# EAGLE design Wash_Hand_v1.2-routing (EAGLE 9.6.1)
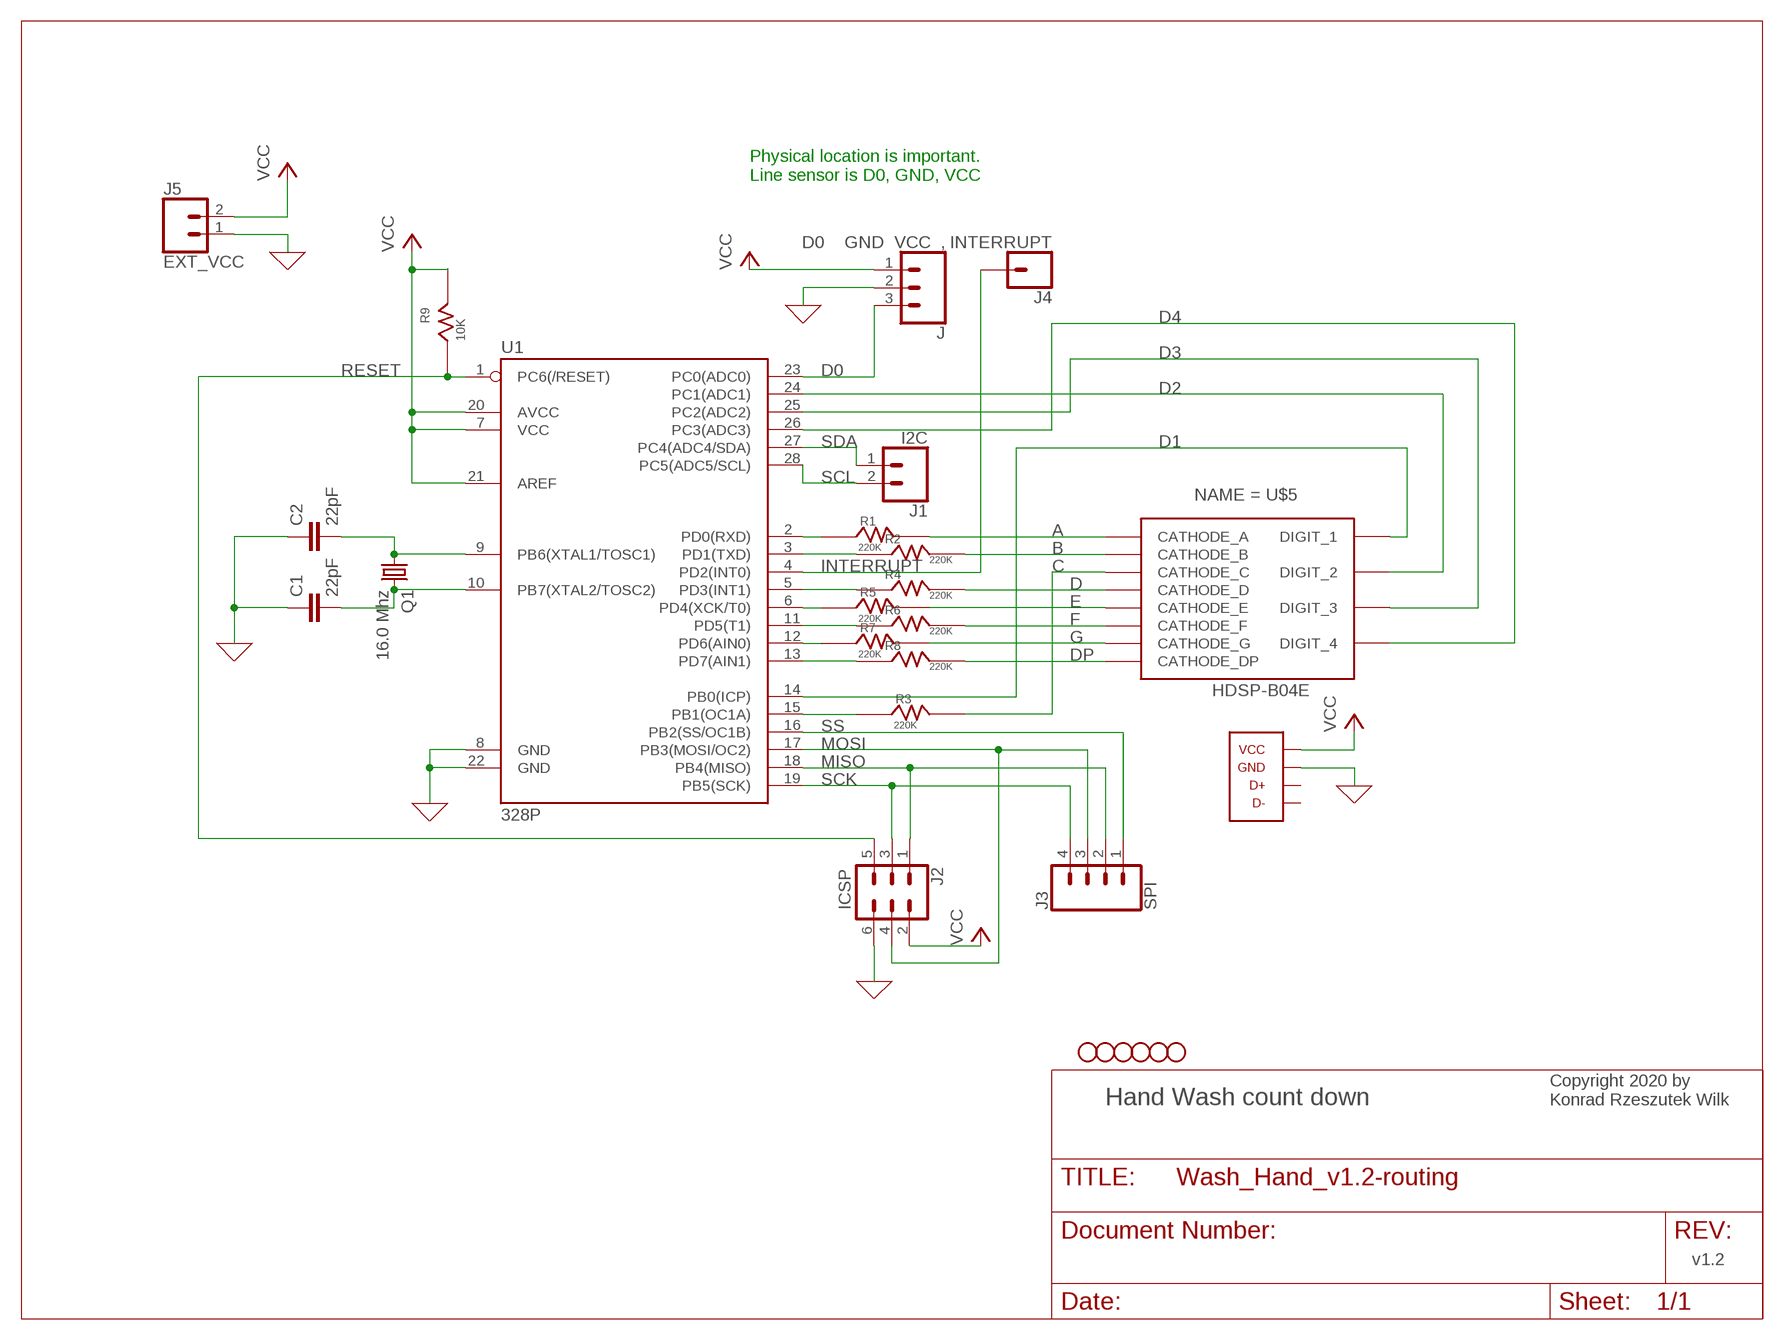
[diagram p0: schematic, sheet 1]

## Parts
C1  22pF  22PF-PTH-2.54MM-200V-5%  [CAP-PTH-2.54]
C2  22pF  22PF-PTH-2.54MM-200V-5%  [CAP-PTH-2.54]
H1  STAND-OFF  [STAND-OFF]
H2  STAND-OFF  [STAND-OFF]
H3  STAND-OFF  [STAND-OFF]
H4  STAND-OFF  [STAND-OFF]
H5  STAND-OFF  [STAND-OFF]
H6  STAND-OFF  [STAND-OFF]
J  D0 GND VCC ,  CONN_03  [1X03]
J1  I2C  CONN_02  [1X02]
J2  ICSP  CONN_03X2FEMALE  [2X3]
J3  SPI  CONN_04  [1X04]
J4  INTERRUPT  CONN_01  [1X01]
J5  EXT_VCC  CONN_02  [1X02]
Q1  16.0 Mhz  CRYSTALHC49S  [HC49/S]
R1  220K  RESISTOR  [RESISTOR]
R2  220K  RESISTOR  [RESISTOR]
R3  220K  RESISTOR  [RESISTOR]
R4  220K  RESISTOR  [RESISTOR]
R5  220K  RESISTOR  [RESISTOR]
R6  220K  RESISTOR  [RESISTOR]
R7  220K  RESISTOR  [RESISTOR]
R8  220K  RESISTOR  [RESISTOR]
R9  10K  RESISTOR  [RESISTOR]
U1  328P  ATMEGA328P_PDIP  [DIP28]
U$4  USB_MICROB_10118194_AMPHENOL  [USB_MICROB_10118194_AMPHENOL]
U$5  HDSP-B04E  [HDSP-B0XE]

## Nets
0: C1.1 C2.1 J2.6 J5.1 J.2 U1.8(GND) U1.22(GND) U$4.5(GND) ; supply symbol labelled GND
A: R1.R_2 U$5.PIN$11(CATHODE_A)
B: R2.R_2 U$5.PIN$7(CATHODE_B)
C: R3.R_2 U$5.PIN$4(CATHODE_C)
D: R4.R_2 U$5.PIN$2(CATHODE_D)
D0: J.3 U1.23(PC0(ADC0))
D1: U1.14(PB0(ICP)) U$5.PIN12(DIGIT_1)
D2: U1.24(PC1(ADC1)) U$5.PIN$9(DIGIT_2)
D3: U1.25(PC2(ADC2)) U$5.PIN$8(DIGIT_3)
D4: U1.26(PC3(ADC3)) U$5.PIN$6(DIGIT_4)
DP: R8.R_2 U$5.PIN$3(CATHODE_DP)
E: R5.R_2 U$5.PIN$1(CATHODE_E)
F: R6.R_2 U$5.PIN$10(CATHODE_F)
G: R7.R_2 U$5.PIN$5(CATHODE_G)
INTERRUPT: J4.1 U1.4(PD2(INT0))
MISO: J2.1 J3.2 U1.18(PB4(MISO))
MOSI: J2.4 J3.3 U1.17(PB3(MOSI/OC2))
N$1: R3.R_1 U1.15(PB1(OC1A))
N$2: R1.R_1 U1.2(PD0(RXD))
N$3: R5.R_1 U1.6(PD4(XCK/T0))
N$4: R7.R_1 U1.12(PD6(AIN0))
N$8: C1.2 Q1.2 U1.10(PB7(XTAL2/TOSC2))
N$9: C2.2 Q1.1 U1.9(PB6(XTAL1/TOSC1))
N$18: R8.R_1 U1.13(PD7(AIN1))
N$19: R6.R_1 U1.11(PD5(T1))
N$20: R4.R_1 U1.5(PD3(INT1))
N$21: R2.R_1 U1.3(PD1(TXD))
RESET: J2.5 R9.R_1 U1.1(PC6(/RESET))
SCK: J2.3 J3.4 U1.19(PB5(SCK))
SCL: J1.2 U1.28(PC5(ADC5/SCL))
SDA: J1.1 U1.27(PC4(ADC4/SDA))
SS: J3.1 U1.16(PB2(SS/OC1B))
VCC: J2.2 J5.2 J.1 R9.R_2 U1.7(VCC) U1.20(AVCC) U1.21(AREF) U$4.1(VCC)
Unconnected: U$4.2(D-) U$4.3(D+)

## Notes on the sheet
- Physical location is important.
  Line sensor is D0, GND, VCC
- Hand Wash count down
- Copyright 2020 by
  Konrad Rzeszutek Wilk
- v1.2

## Library data of the parts
C1 C2 = SparkFun-Capacitors:22PF: 22pF ceramic capacitors A capacitor is a passive two-terminal electrical component used to store electrical energy temporarily in an electric field.; PROD_ID: CAP-09128
H1-H6 = SparkFun-Hardware:STAND-OFF: Stand Off Drill holes for mechanically mounting via screws, standoffs, etc. Note: Use the keepout ring to avoid running the screw head into surrounding components. Variant Overviews STAND-OFF - Mechanical footprint for a #4 phillips button head screw. STAND-OFF-TIGHT - Mechanical footprint for a #4 phillips button head screw, Example SparkFun Products Screw - Phillips Head (1/4", 4-40, 10 pack) <https://www.sparkfun.com/products/10453> (PRT-10453) Screw - Phillips Head (1/2", 4-40, 10 pack) <https://www.sparkfun.com/products/10452> (PRT-10452) Screw - Phillips Head (3/4", 4-40, 10 pack) <https://www.sparkfun.com/products/10451> (PRT-10451) Screw - Phillips Head (1", 4-40, 10 pack) <https://www.sparkfun.com/products/10450> (PRT-10450)
J = SparkFun-Connectors:CONN_03: Multi connection point. Often used as Generic Header-pin footprint for 0.1 inch spaced/style header connections On any of the 0.1 inch spaced packages, you can populate with these: Break Away Headers - Straight <https://www.sparkfun.com/products/116> (PRT-00116) Break Away Male Headers - Right Angle <https://www.sparkfun.com/products/553> (PRT-00553) Female Headers <https://www.sparkfun.com/products/115> (PRT-00115) Break Away Headers - Machine Pin <https://www.sparkfun.com/products/117> (PRT-00117) Break Away Female Headers - Swiss Machine Pin <https://www.sparkfun.com/products/743> (PRT-00743) Stackable Header - 3 Pin (Female, 0.1") <https://www.sparkfun.com/products/13875> (PRT-13875) For SCREWTERMINALS and SPRING TERMINALS visit here: Screw Terimnals on SparkFun.com <https://www.sparkfun.com/search/results?term=Screw+Terminals> (5mm/3.5mm/2.54mm spacing) This device is also useful as a general connection point to wire up your design to another part of your project. Our various solder wires solder well into these plated through hole pads. Hook-Up Wire - Assortment (Stranded, 22 AWG) <https://www.sparkfun.com/products/11375> (PRT-11375) Hook-Up Wire - Assortment (Solid Core, 22 AWG) <https://www.sparkfun.com/products/11367> (PRT-11367) View the entire wire category on our website here <https://www.sparkfun.com/categories/141> Special notes: Molex polarized connector foot print use with SKU : PRT-08232 with associated crimp pins and housings.
J1 J5 = SparkFun-Connectors:CONN_02: Multi connection point. Often used as Generic Header-pin footprint for 0.1 inch spaced/style header connections On any of the 0.1 inch spaced packages, you can populate with these: Break Away Headers - Straight <https://www.sparkfun.com/products/116> (PRT-00116) Break Away Male Headers - Right Angle <https://www.sparkfun.com/products/553> (PRT-00553) Female Headers <https://www.sparkfun.com/products/115> (PRT-00115) Break Away Headers - Machine Pin <https://www.sparkfun.com/products/117> (PRT-00117) Break Away Female Headers - Swiss Machine Pin <https://www.sparkfun.com/products/743> (PRT-00743) For SCREWTERMINALS and SPRING TERMINALS visit here: Screw Terimnals on SparkFun.com <https://www.sparkfun.com/search/results?term=Screw+Terminals> (5mm/3.5mm/2.54mm spacing) This device is also useful as a general connection point to wire up your design to another part of your project. Our various solder wires solder well into these plated through hole pads. Hook-Up Wire - Assortment (Stranded, 22 AWG) <https://www.sparkfun.com/products/11375> (PRT-11375) Hook-Up Wire - Assortment (Solid Core, 22 AWG) <https://www.sparkfun.com/products/11367> (PRT-11367) View the entire wire category on our website here <https://www.sparkfun.com/categories/141> Special notes: Molex polarized connector foot print use with: PRT-08233 with associated crimp pins and housings. 2.54_SCREWTERM for use with PRT-10571. 3.5mm Screw Terminal footprints for PRT-08084 5mm Screw Terminal footprints for use with PRT-08432
J2 = SparkFun-Connectors:CONN_03X2: Multi connection point. Often used as Generic Header-pin footprint for 0.1 inch spaced/style header connections You can populate with any combo of single row headers, but if you'd like an exact match, check these: Header - 2x3 (Male, 0.1") <https://www.sparkfun.com/products/12807> (PRT-12807) Header - 2x3 (Female, 0.1") <https://www.sparkfun.com/products/13010> (PRT-13010) 2x3 Pin Shrouded Header <https://www.sparkfun.com/products/10877> (PRT-10877) On any of the 0.1 inch spaced packages, you can populate with these: Break Away Headers - Straight <https://www.sparkfun.com/products/116> (PRT-00116) Break Away Male Headers - Right Angle <https://www.sparkfun.com/products/553> (PRT-00553) Female Headers <https://www.sparkfun.com/products/115> (PRT-00115) Break Away Headers - Machine Pin <https://www.sparkfun.com/products/117> (PRT-00117) Break Away Female Headers - Swiss Machine Pin <https://www.sparkfun.com/products/743> (PRT-00743) Special note: the shrouded connector mates well with our 3x2 ribbon cables: Ribbon Crimp Connector - 6-pin (2x3, Female) <https://www.sparkfun.com/products/10651> (PRT-10651) Ribbon Cable - 6 wire (15ft) <https://www.sparkfun.com/products/10646> (PRT-10646); PROD_ID: CONN-11566; VALUE: FEMALE 2x3
J3 = SparkFun-Connectors:CONN_04: Multi connection point. Often used as Generic Header-pin footprint for 0.1 inch spaced/style header connections On any of the 0.1 inch spaced packages, you can populate with these: Break Away Headers - Straight <https://www.sparkfun.com/products/116> (PRT-00116) Break Away Male Headers - Right Angle <https://www.sparkfun.com/products/553> (PRT-00553) Female Headers <https://www.sparkfun.com/products/115> (PRT-00115) Break Away Headers - Machine Pin <https://www.sparkfun.com/products/117> (PRT-00117) Break Away Female Headers - Swiss Machine Pin <https://www.sparkfun.com/products/743> (PRT-00743) For SCREWTERMINALS and SPRING TERMINALS visit here: Screw Terimnals on SparkFun.com <https://www.sparkfun.com/search/results?term=Screw+Terminals> (5mm/3.5mm/2.54mm spacing) This device is also useful as a general connection point to wire up your design to another part of your project. Our various solder wires solder well into these plated through hole pads. Hook-Up Wire - Assortment (Stranded, 22 AWG) <https://www.sparkfun.com/products/11375> (PRT-11375) Hook-Up Wire - Assortment (Solid Core, 22 AWG) <https://www.sparkfun.com/products/11367> (PRT-11367) View the entire wire category on our website here <https://www.sparkfun.com/categories/141> Special notes: Molex polarized connector foot print use with SKU : PRT-08231 with associated crimp pins and housings. 1MM SMD Version SKU: PRT-10208; PROD_ID: CONN-09696
J4 = SparkFun-Connectors:CONN_01: Single connection point. Often used as Generic Header-pin footprint for 0.1 inch spaced/style header connections On any of the 0.1 inch spaced packages, you can populate with these: Break Away Headers - Straight <https://www.sparkfun.com/products/116> (PRT-00116) Break Away Male Headers - Right Angle <https://www.sparkfun.com/products/553> (PRT-00553) Female Headers <https://www.sparkfun.com/products/115> (PRT-00115) Break Away Headers - Machine Pin <https://www.sparkfun.com/products/117> (PRT-00117) Break Away Female Headers - Swiss Machine Pin <https://www.sparkfun.com/products/743> (PRT-00743) This device is also useful as a general connection point to wire up your design to another part of your project. Our various solder wires solder well into these plated through hole pads. Hook-Up Wire - Assortment (Stranded, 22 AWG) <https://www.sparkfun.com/products/11375> (PRT-11375) Hook-Up Wire - Assortment (Solid Core, 22 AWG) <https://www.sparkfun.com/products/11367> (PRT-11367) View the entire wire category on our website here <https://www.sparkfun.com/categories/141> Special notes: SMTSO-256-ET is a "flush mount" nut for a 4-40 screw. We mostly use this on specialty testbeds; it is a nice way to connect hardware to your PCB at an adjustable hieght. Also note, the SNAP packages are for using a snappable style connector. We sell a baggie of snaps and they are also used on two LilyPad designs: Snap Assortment - 30 pack (male and female) <https://www.sparkfun.com/products/11347> (DEV-11347) LilyPad Arduino SimpleSnap <https://www.sparkfun.com/products/10941> (DEV-10941) LilyPad SimpleSnap Protoboard <https://www.sparkfun.com/products/10940> (DEV-10940)
Q1 = adafruit:CRYSTAL: CRYSTAL; OC_FARNELL: 1667008; OC_NEWARK: unknown
R1-R9 = PCB_CLASS_PREMADE_COMPONENTS:RESISTOR
U1 = SparkFun-IC-Microcontroller:ATMEGA328P_PDIP: Atmel 328P Through hole ATMEGA328P uC used in the Arduino 32kb flash, 1k EEPROM, 2k SRAM Datasheet <http://www.sparkfun.com/datasheets/Components/SMD/ATMega328.pdf> SparkFun Products Storefront component: AVR 28 Pin 20MHz 32K 6A/D - ATMega328P <https://www.sparkfun.com/products/9061> (COM-09061) SparkFun Simon Says - Through-Hole Soldering Kit <https://www.sparkfun.com/products/10547> (KIT-10547) SparkFun Learn to Solder - Simon Says <https://www.sparkfun.com/products/13708> (KIT-13708) SparkFun BigTime Watch Kit <https://www.sparkfun.com/products/11734> (KIT-11734) SparkFun ClockIt <https://www.sparkfun.com/products/10930> (KIT-10930) SparkFun Serial Enabled LCD Kit <https://www.sparkfun.com/products/10097> (LCD-10097) SparkFun Simon Tilts - Through Hole Soldering Kit <https://www.sparkfun.com/products/12634> (KIT-12634) SparkFun Frequency Counter Kit <https://www.sparkfun.com/products/10140> (KIT-10140) FabFM Radio Kit <https://www.sparkfun.com/products/11043> (KIT-11043) SparkFun Binary Blaster Kit <https://www.sparkfun.com/products/12037> (KIT-12037) SparkFun Metro-Gnome <https://www.sparkfun.com/products/9236> (KIT-09236) ATmega328 with Arduino Optiboot (Uno) <https://www.sparkfun.com/products/10524> (DEV-10524); PROD_ID: IC-09136
U$4 = PCB_CLASS_PREMADE_COMPONENTS:USB_MICROB_10118194_AMPHENOL
U$5 = PCB_CLASS_PREMADE_COMPONENTS:HDSP-B04E: 7 Segment LED light 0.56"

## Board
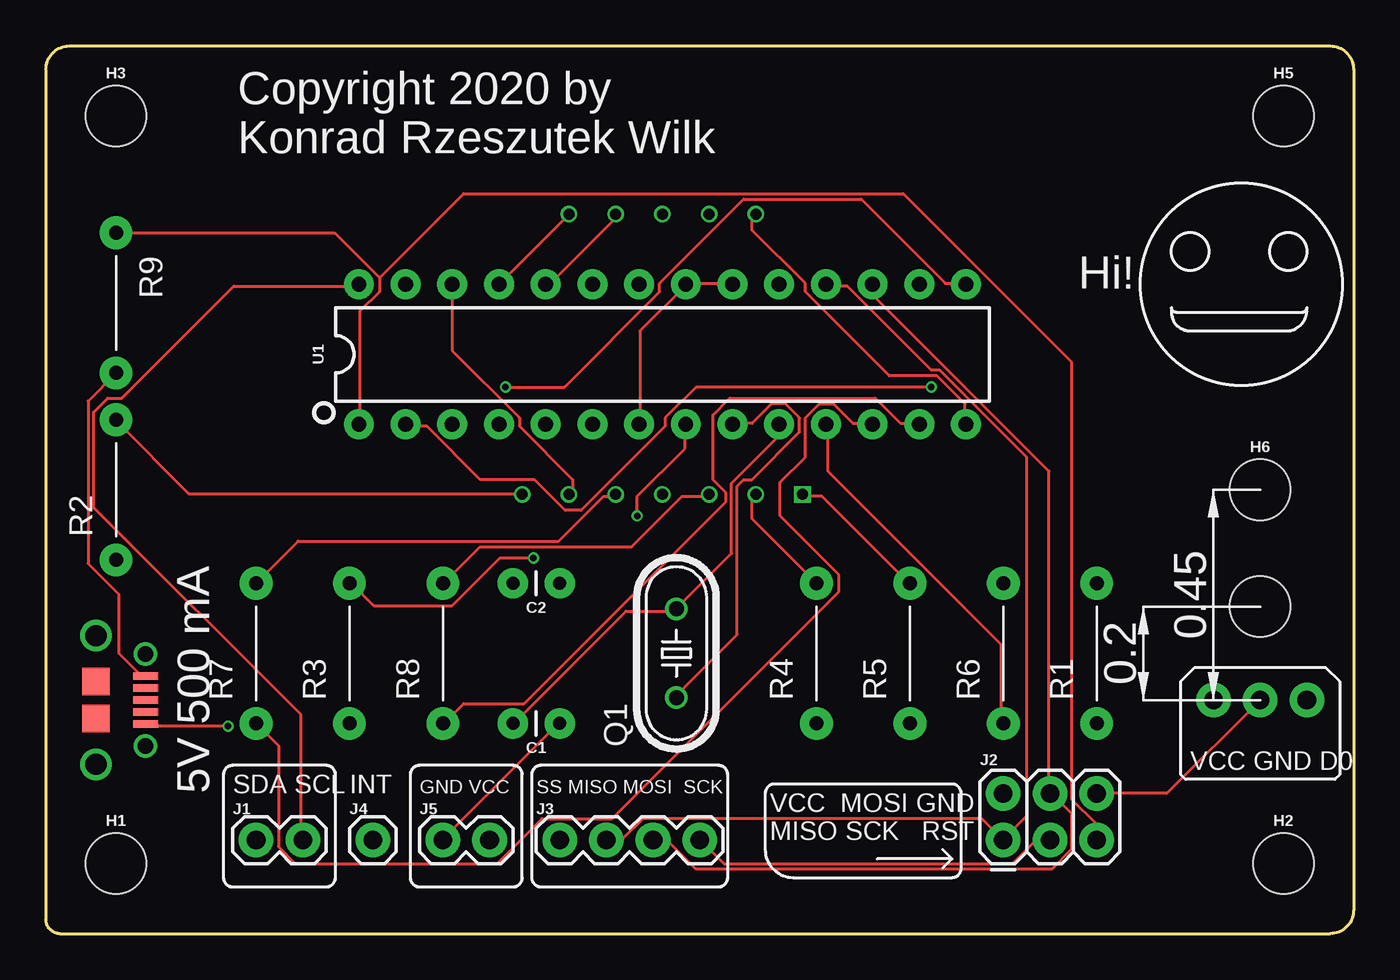
[diagram p1: board, top side]
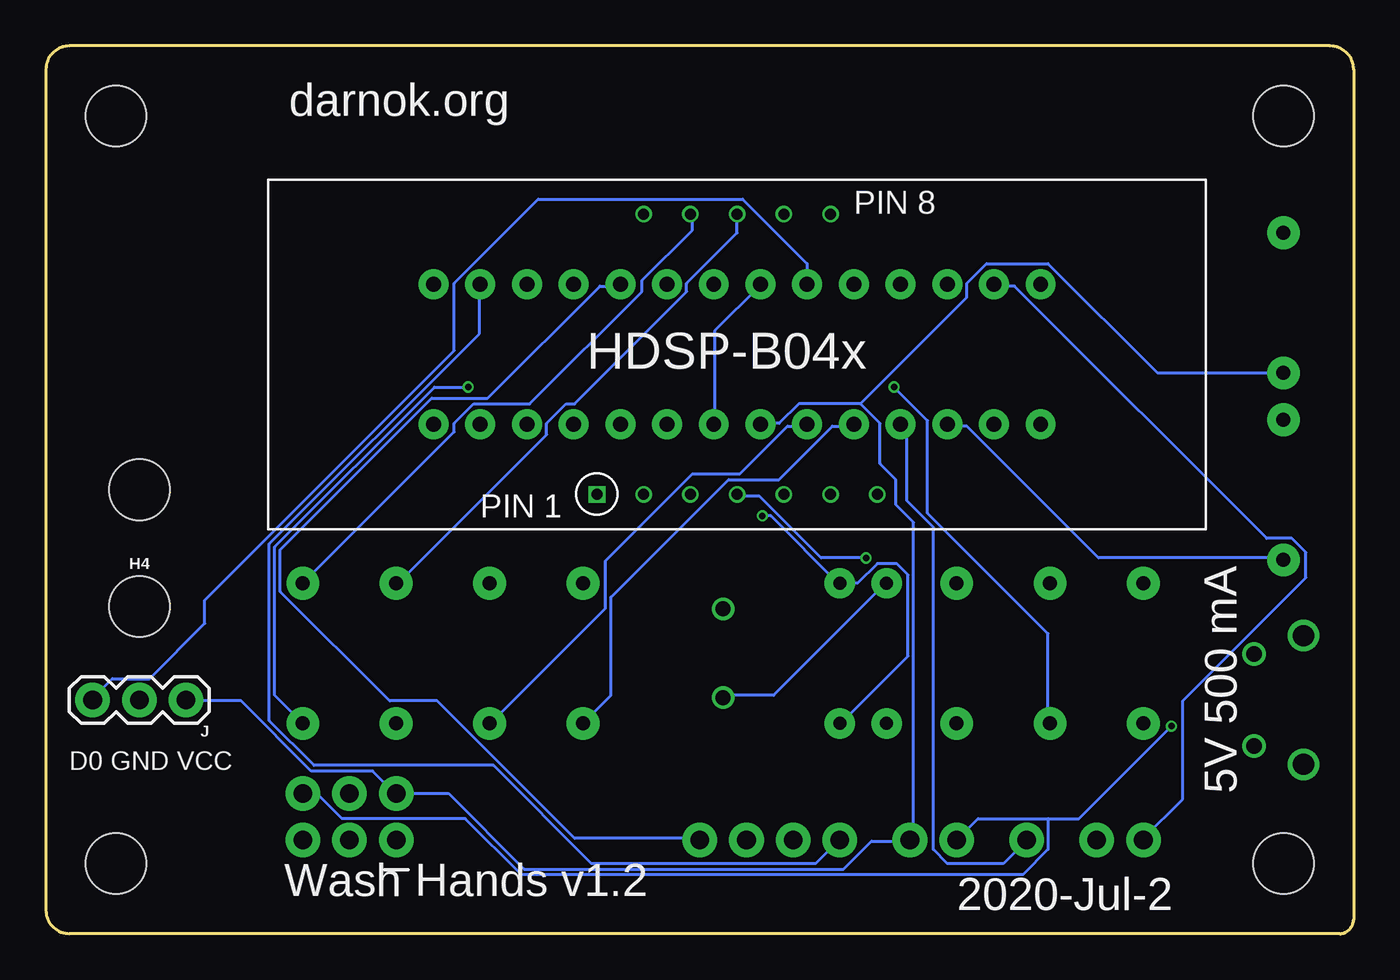
[diagram p2: board, bottom side, seen from below]

Size 71.12 x 48.26 mm. Coordinates in mm from the lower left corner, seen from the top.
Outline: 0,46.99 0,0.76 arc90 0.76,0 69.85,0 arc90 71.12,1.27 71.12,46.99 arc90 69.85,48.26 1.27,48.26 arc90 0,46.99
Copper layers (1*16): Top 0.035559375mm / dielectric 1.6mm / Bottom 0.035559375mm
Design rules "oshpark-2layer": minimum track width 6mil, minimum drill 10mil, track to track 6mil, track to pad 6mil, pad to pad 6mil, via to via 6mil, smd to smd 6mil, copper to edge 15mil, drill to drill 6mil, minimum pad ring 5mil, minimum via ring 5mil, stop-mask expansion 2.5mil, vias tented up to drill 0mil, thermal gap 10mil

### Footprints (pad centres in the part's own frame; a part is rotated, then mirrored left to right if it is on the bottom)
CAP-PTH-2.54 = drill 0.7 pad 1.651: 1 -1.27,0; 2 1.27,0
STAND-OFF = hole 3.302: 0,0
1X03 = drill 1.016 pad 1.88: 1 0,0; 2 2.54,0; 3 5.08,0
1X02 = drill 1.016 pad 1.88: 1 0,0; 2 2.54,0
2X3 = drill 1.016 pad 1.88: 1 0,0; 2 0,2.54; 3 2.54,0; 4 2.54,2.54; 5 5.08,0; 6 5.08,2.54
1X04 = drill 1.016 pad 1.88: 1 0,0; 2 2.54,0; 3 5.08,0; 4 7.62,0
1X01 = drill 1.016 pad 1.88: 1 0,0
HC49/S = drill 0.813: 1 -2.413,0; 2 2.413,0
RESISTOR = drill 0.762 pad 1.778: R_1 0,0; R_2 7.62,0
DIP28 = drill 0.813 pad 1.626: 1 -16.51,-3.81; 2 -13.97,-3.81; 3 -11.43,-3.81; 4 -8.89,-3.81; 5 -6.35,-3.81; 6 -3.81,-3.81; 7 -1.27,-3.81; 8 1.27,-3.81; 9 3.81,-3.81; 10 6.35,-3.81; 11 8.89,-3.81; 12 11.43,-3.81; 13 13.97,-3.81; 14 16.51,-3.81; 15 16.51,3.81; 16 13.97,3.81; 17 11.43,3.81; 18 8.89,3.81; 19 6.35,3.81; 20 3.81,3.81; 21 1.27,3.81; 22 -1.27,3.81; 23 -3.81,3.81; 24 -6.35,3.81; 25 -8.89,3.81; 26 -11.43,3.81; 27 -13.97,3.81; 28 -16.51,3.81
USB_MICROB_10118194_AMPHENOL = smd 0.4 x 1.35: 1 -1.3,4.15; 2 -0.65,4.15; 3 0,4.15; 4 0.65,4.15; 5 1.3,4.15 | smd 1.5 x 1.5: P$1 -1,1.45; P$2 1,1.45 | drill 0.85 pad 1.25: P$8 -2.5,4.15; P$9 2.5,4.15 | drill 1.15 pad 1.55: P$10 -3.5,1.45; P$11 3.5,1.45
HDSP-B0XE = drill 0.6: PIN12 -5.08,7.62; PIN$2 -5.08,-7.62; PIN$3 -2.54,-7.62; PIN$4 0,-7.62; PIN$5 2.54,-7.62; PIN$6 5.08,-7.62; PIN$7 7.62,-7.62; PIN$8 5.08,7.62; PIN$9 2.54,7.62; PIN$10 0,7.62; PIN$11 -2.54,7.62 | drill 0.6 square: PIN$1 -7.62,-7.62

### Placement (x,y rotation side)
C1  26.67,11.43 180 top
C2  26.67,19.05 180 top
H1  3.81,3.81 0 top
H2  67.31,3.81 0 top
H3  3.81,44.45 0 top
H4  66.04,17.78 0 bottom
H5  67.31,44.45 0 top
H6  66.04,24.13 0 top
J  63.5,12.7 180 bottom
J1  11.43,5.08 0 top
J2  52.07,5.08 0 top
J3  27.94,5.08 0 top
J4  17.78,5.08 0 top
J5  21.59,5.08 0 top
Q1  34.29,15.24 90 top
R1  57.15,11.43 90 top
R2  3.81,20.32 90 top
R3  16.51,11.43 90 top
R4  41.91,11.43 90 top
R5  46.99,11.43 90 top
R6  52.07,11.43 90 top
R7  11.43,11.43 90 top
R8  21.59,11.43 90 top
R9  3.81,38.1 270 top
U1  33.53,31.5 0 top
U$4  1.27,12.7 270 top
U$5  33.53,31.5 0 bottom

### Tracks (layer width: path | path; a pad name or v marks a point on that pad's centre or on a via)
0  (via drill 0.35)
  Top 0.152: J2.6 60.96,7.62 J.2 | v9.91,11.28 5.49,11.28 U$4.5 | C1.1 27.89,11.43 21.64,5.18 J5.1 | v32.16,22.71 32.16,23.77 34.75,26.36 34.75,27.58 U1.8
  Bottom 0.152: U1.8 34.75,27.74 34.75,32.77 32.31,35.2 U1.22 | v9.91,11.28 14.94,6.25 16.61,6.25 | 16.61,6.25 20.42,6.25 J5.1 | C1.1 27.89,11.43 24.23,15.09 24.23,19.51 24.84,20.12 25.91,20.12 26.98,19.05 C2.1 28.04,19.05 31.7,22.71 v32.16,22.71 | J2.6 56.39,7.62 55.02,6.25 48.31,6.25 45.26,3.2 17.98,3.2 16.61,4.57 16.61,6.25
A
  Bottom 0.152: R1.R_2 48.92,27.28 48.92,27.74 47.85,28.8 44.81,28.8 38.71,34.9 38.71,35.51 35.97,38.25 35.97,39.01 U$5.PIN$11
B
  Top 0.152: U$5.PIN$7 26.21,23.93 7.77,23.93 3.81,27.89 R2.R_2
C  (via drill 0.35)
  Top 0.152: v26.52,20.42 24.69,20.42 22.1,17.83 17.83,17.83 16.61,19.05 R3.R_2
  Bottom 0.152: v26.52,20.42 28.96,20.42 32.31,23.77 33.53,23.77 U$5.PIN$4
D
  Top 0.152: R4.R_2 38.41,22.55 38.41,23.77 U$5.PIN$2
D0
  Bottom 0.152: U1.23 29.72,36.42 33.22,39.93 44.35,39.93 48.92,35.36 48.92,31.7 62.48,18.14 62.48,16.87 65.48,13.87 67.51,13.87 68.58,12.8 J.3
D1
  Top 0.152: U$5.PIN12 38.41,39.01 38.41,38.25 41.3,35.36 41.3,34.9 45.87,30.33 48.46,30.33 49.99,28.8 49.99,27.74 U1.14
D2
  Top 0.152: U$5.PIN$9 31.09,39.01 27.28,35.2 U1.24
D3
  Top 0.152: U1.25 28.35,39.01 28.65,39.01 U$5.PIN$8
D4
  Top 0.152: U1.26 22.1,31.7 25.76,28.04 25.76,27.58 28.65,24.69 28.65,23.93 U$5.PIN$6
DP
  Top 0.152: U$5.PIN$3 35.81,23.77 34.59,23.77 31.85,21.03 23.62,21.03 21.64,19.05 R8.R_2
E
  Top 0.152: U$5.PIN$1 40.84,23.77 42.22,23.77 46.94,19.05 R5.R_2
F
  Bottom 0.152: U$5.PIN$10 33.53,38.1 36.27,35.36 36.27,34.9 42.37,28.8 42.82,28.8 43.89,27.74 43.89,27.13 51.97,19.05 R6.R_2
G
  Top 0.152: R7.R_2 13.72,21.34 27.89,21.34 30.33,23.77 31.09,23.77 U$5.PIN$5
INTERRUPT
  Bottom 0.152: J4.1 19.05,3.81 22.1,3.81 22.86,4.57 22.86,22.1 24.28,23.52 24.28,27.33 U1.4
MISO
  Top 0.152: U1.18 42.52,35.2 43.59,35.2 48.16,30.63 48.62,30.63 53.34,25.91 53.34,6.4 52.12,5.18 J2.1 50.9,6.25 32.46,6.25 31.39,5.18 30.48,5.18 J3.2
MOSI
  Top 0.152: U1.17 44.96,34.75 54.56,25.15 54.56,7.62 J2.4 54.71,7.62 55.78,6.55 55.78,4.57 54.71,3.5 35.36,3.5 33.83,5.03 33.07,5.03 J3.3
N$1  (via drill 0.35)
  Top 0.152: v24.99,29.72 28.19,29.72 33.38,34.9 33.38,35.36 37.95,39.93 44.35,39.93 48.92,35.36 49.99,35.36 U1.15
  Bottom 0.152: v24.99,29.72 23.16,27.89 23.16,22.86 16.61,16.31 16.61,11.43 R3.R_1
N$2  (via drill 0.35)
  Top 0.152: v48.16,29.72 35.36,29.72 33.68,28.04 33.68,27.58 29.11,23.01 28.25,23.01 26.57,24.69 23.62,24.69 20.73,27.58 19.66,27.58 U1.2
  Bottom 0.152: v48.16,29.72 49.99,29.72 58.67,21.03 58.67,12.95 R1.R_1
N$3
  Bottom 0.152: U1.6 29.72,27.58 30.79,27.58 33.38,24.99 35.97,24.99 40.69,20.27 40.69,17.68 46.94,11.43 R5.R_1
N$4
  Top 0.152: R7.R_1 12.65,10.21 12.65,4.72 13.56,3.81 24.54,3.81 26.98,6.25 30.79,6.25 43.13,18.59 43.13,19.51 39.93,22.71 39.93,24.54 41.3,25.91 41.3,28.04 42.06,28.8 42.82,28.8 43.89,27.74 44.96,27.74 U1.12
N$8
  Top 0.152: C1.2 25.45,11.43 31.55,17.53 34.29,17.53 Q1.2 34.29,17.68 37.29,20.68 37.29,24.49 39.78,26.98 39.78,27.58 U1.10
N$9
  Top 0.152: U1.9 37.34,27.74 38.41,27.74 39.47,28.8 40.23,28.8 41,28.04 41,27.28 38.41,24.69 37.95,24.69 37.59,24.33 37.59,16.26 34.29,12.95 Q1.1
  Bottom 0.152: Q1.1 34.29,12.95 31.55,12.95 25.45,19.05 C2.2
N$18
  Top 0.152: U1.13 47.4,27.74 46.48,27.74 45.11,29.11 37.19,29.11 36.27,28.19 36.27,24.69 36.98,23.98 36.98,23.47 26.01,12.5 22.71,12.5 21.64,11.43 R8.R_1
N$19
  Top 0.152: U1.11 42.52,27.58 42.52,25.15 51.97,15.7 51.97,11.43 R6.R_1
N$20
  Bottom 0.152: R4.R_1 40.39,12.95 40.39,18.29 33.98,24.69 31.24,24.69 28.35,27.58 27.28,27.58 U1.5
N$21
  Bottom 0.152: U1.3 22.1,27.58 21.03,27.58 13.87,20.42 3.81,20.42 R2.R_1
RESET
  Top 0.152: 18.14,35.66 18.14,34.9 17.07,33.83 17.07,27.74 U1.1 | 18.14,35.66 15.7,38.1 R9.R_1 | J2.5 57.15,5.94 55.78,7.32 55.78,31.09 46.63,40.23 22.71,40.23 18.14,35.66
SCK
  Top 0.152: J2.3 54.56,5.03 53.8,5.03 52.58,3.81 36.88,3.81 35.66,5.03 J3.4
  Bottom 0.152: U1.19 39.93,35.2 41,35.2 47.09,29.11 50.14,29.11 58.37,20.88 58.37,18.59 52.43,12.65 49.84,12.65 42.37,5.18 35.66,5.18 J3.4
SCL
  Top 0.152: U1.28 16.92,35.2 10.21,35.2 4.12,29.11 3.35,29.11 2.59,28.35 2.59,23.16 13.87,11.89 13.87,5.18 J1.2
SDA
  Bottom 0.152: U1.27 19.51,35.2 18.44,35.2 4.72,21.49 3.35,21.49 2.59,20.73 2.59,19.36 9.3,12.65 9.3,7.32 11.43,5.18 J1.1
SS
  Bottom 0.152: U1.16 47.55,35.2 47.55,32.61 58.98,21.18 58.98,11.58 56.54,9.14 46.79,9.14 41.45,3.81 29.26,3.81 28.04,5.03 J3.1
VCC
  Top 0.152: R9.R_2 2.29,28.96 2.29,20.12 3.96,18.44 3.96,15.24 5.18,14.02 5.33,14.02 U$4.1 | U1.7 32.31,27.74 32.31,32.77 34.75,35.2 U1.21 34.9,35.36 37.34,35.36 U1.20
  Bottom 0.152: J.1 63.4,12.65 60.5,12.65 56.69,8.84 53.34,8.84 52.12,7.62 J2.2 49.23,7.62 45.11,3.5 27.74,3.5 26.21,5.03 24.23,5.03 J5.2 24.08,5.18 23.93,5.33 23.93,22.35 24.89,23.32 24.89,24.69 25.76,25.55 25.76,27.74 26.82,28.8 | 26.82,28.8 30.18,28.8 31.24,27.74 32.16,27.74 U1.7 | R9.R_2 10.67,30.48 16.61,36.42 19.96,36.42 21.03,35.36 21.03,34.59 26.82,28.8

### Text on the board
tNames: Copyright 2020 by / Konrad Rzeszutek Wilk | Hi! | VCC GND D0 | 5V 500 mA | SDA SCL | INT | GND VCC | SS MISO MOSI SCK | VCC MOSI GND / MISO SCK RST
bNames: darnok.org | D0 GND VCC | 5V 500 mA | Wash Hands v1.2 | 2020-Jul-2